# EAGLE design display57 (EAGLE 4.09)
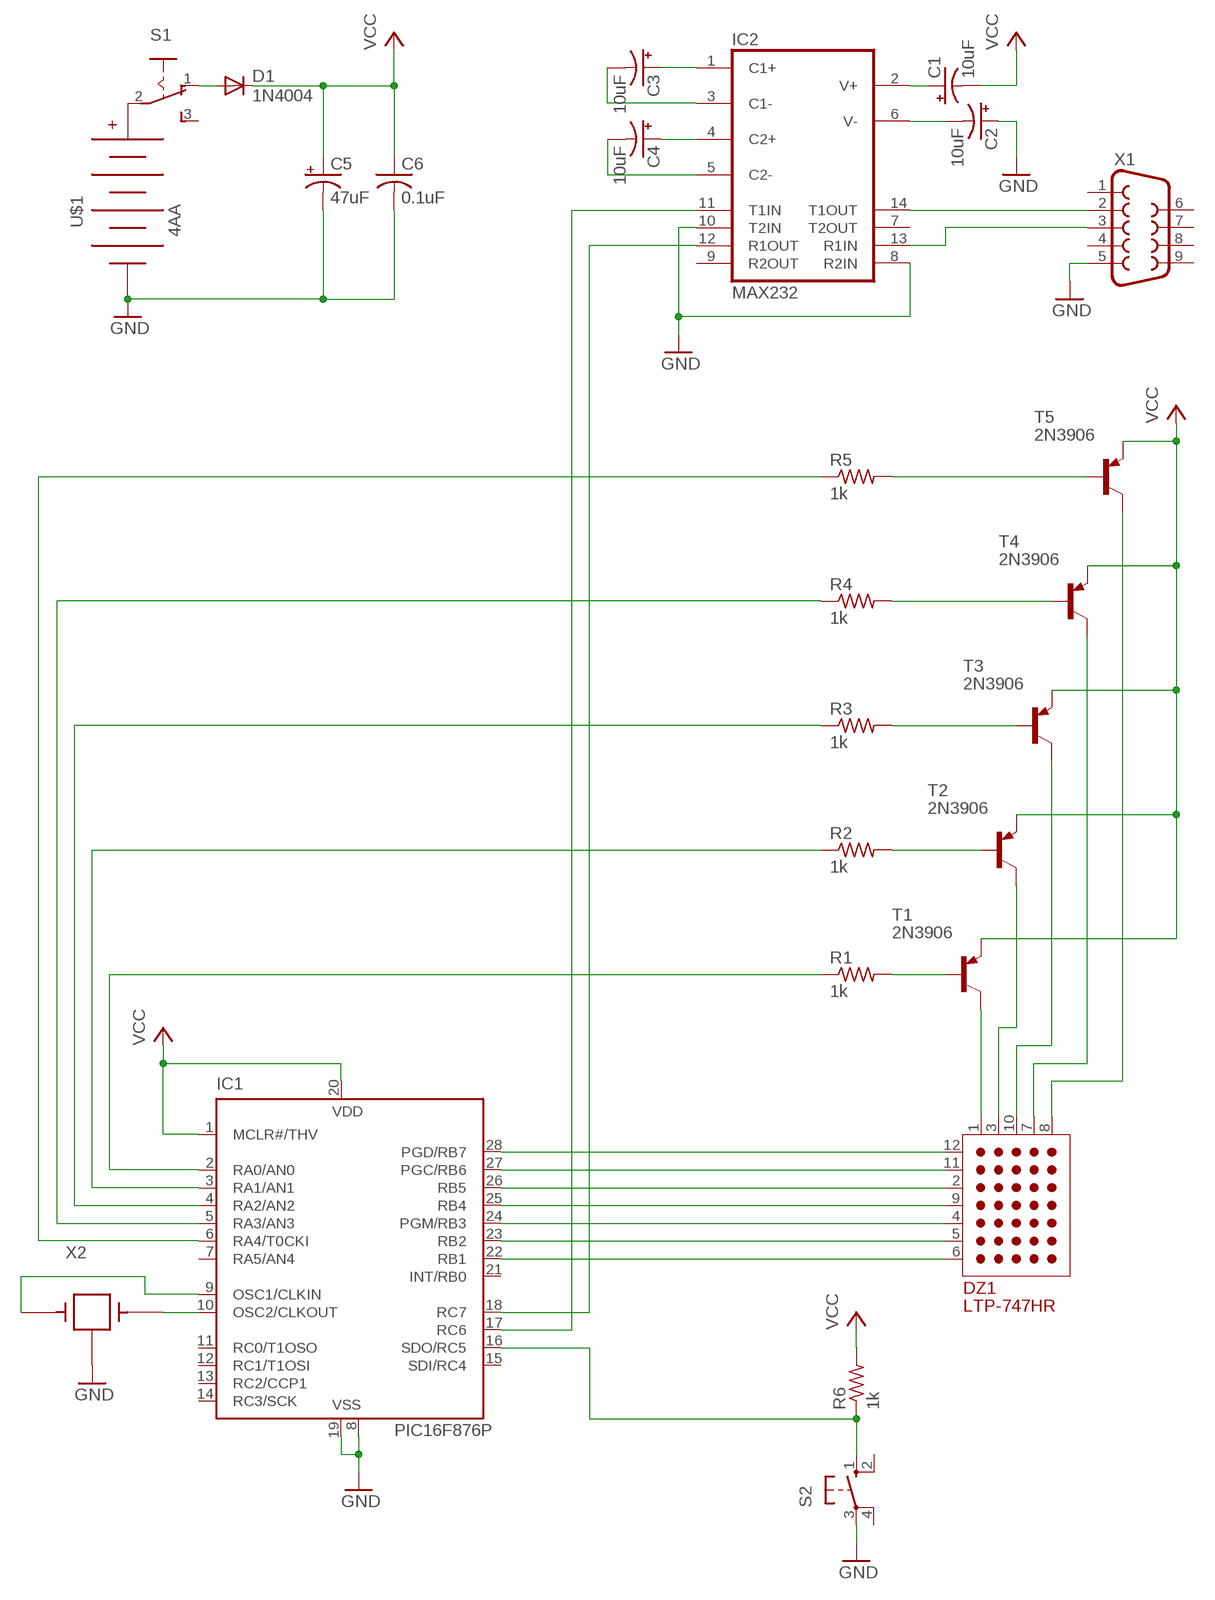
[diagram p0: schematic, sheet 1]

## Parts
C1  10uF  CPOL-USE2.5-5V  [E2,5-4R]
C2  10uF  CPOL-USE2.5-5V  [E2,5-4R]
C3  10uF  CPOL-USE2.5-5V  [E2,5-4R]
C4  10uF  CPOL-USE2.5-5V  [E2,5-4R]
C5  47uF  CPOL-USE5-13  [E5-13]
C6  0.1uF  C-US050-025X075  [C050-025X075]
D1  1N4004  [DO41-10]
DZ1  LTP-747HR  [LTP-747HR]
IC1  PIC16F876P  [DIL28-6]
IC2  MAX232  [DIL16]
R1  1k  R-US_0204/7  [0204/7]
R2  1k  R-US_0204/7  [0204/7]
R3  1k  R-US_0204/7  [0204/7]
R4  1k  R-US_0204/7  [0204/7]
R5  1k  R-US_0204/7  [0204/7]
R6  1k  R-US_0204/7  [0204/7]
S1  M251  [M251]
S2  10-XX  [B3F-10XX]
T1  2N3906  [TO92]
T2  2N3906  [TO92]
T3  2N3906  [TO92]
T4  2N3906  [TO92]
T5  2N3906  [TO92]
U$1  4AA  [4AA]
X1  F09H  [F09H]
X2  CERRES0.2IN  [XTAL0.2IN]

## Nets
GND: C2.+ C5.- C6.2 IC1.8(VSS) IC1.19(VSS) IC2.8(R2IN) IC2.10(T2IN) S2.3(P) U$1.P$2 X1.5 X2.P$3
N$1: IC1.10(OSC2/CLKOUT) X2.P$2
N$2: IC1.9(OSC1/CLKIN) X2.P$1
N$3: C2.- IC2.6(V-)
N$4: C3.+ IC2.1(C1+)
N$5: IC2.13(R1IN) X1.3
N$6: C1.+ IC2.2(V+)
N$7: IC1.17(RC6) IC2.11(T1IN)
N$8: C4.+ IC2.4(C2+)
N$9: C4.- IC2.5(C2-)
N$10: S1.2(P) U$1.P$1
N$11: C3.- IC2.3(C1-)
N$12: IC2.14(T1OUT) X1.2
N$13: R1.2 T1.2(B)
N$14: IC1.18(RC7) IC2.12(R1OUT)
N$15: R5.2 T5.2(B)
N$16: D1.A S1.1(O)
N$17: R2.2 T2.2(B)
N$18: R3.2 T3.2(B)
N$19: R4.2 T4.2(B)
N$20: DZ1.1(C1) T1.1(C)
N$21: DZ1.8(C5) T5.1(C)
N$22: DZ1.7(C4) T4.1(C)
N$23: DZ1.10(C3) T3.1(C)
N$24: DZ1.3(C2) T2.1(C)
N$25: DZ1.12(R1) IC1.28(PGD/RB7)
N$26: DZ1.11(R2) IC1.27(PGC/RB6)
N$27: DZ1.2(R3) IC1.26(RB5)
N$28: DZ1.9(R4) IC1.25(RB4)
N$29: DZ1.4(R5) IC1.24(PGM/RB3)
N$30: DZ1.5(R6) IC1.23(RB2)
N$31: DZ1.6(R7) IC1.22(RB1)
N$32: IC1.16(SDO/RC5) R6.1 S2.1(S)
N$33: IC1.3(RA1/AN1) R2.1
N$34: IC1.4(RA2/AN2) R3.1
N$35: IC1.5(RA3/AN3) R4.1
N$36: IC1.6(RA4/T0CKI) R5.1
N$38: IC1.2(RA0/AN0) R1.1
VCC: C1.- C5.+ C6.1 D1.C IC1.1(MCLR#/THV) IC1.20(VDD) R6.2 T1.3(E) T2.3(E) T3.3(E) T4.3(E) T5.3(E)
Unconnected: IC1.7(RA5/AN4) IC1.11(RC0/T1OSO) IC1.12(RC1/T1OSI) IC1.13(RC2/CCP1) IC1.14(RC3/SCK) IC1.15(SDI/RC4) IC1.21(INT/RB0) IC2.7(T2OUT) IC2.9(R2OUT) S1.3(S) S2.2(S1) S2.4(P1) X1.1 X1.4 X1.6 X1.7 X1.8 X1.9

## Power pins joined to a net without a drawn wire
GND: IC2.15(GND)
VCC: IC2.16(VCC)

## Library data of the parts
C1-C5 = rcl:CPOL-US: POLARIZED CAPACITOR, American symbol
C6 = rcl:C-US: CAPACITOR, American symbol
D1 = diode:1N4004: DIODE general purpose rectifier, 1 A
DZ1 = ledmatrix:LTP-747HR: 5x7 Dot Matrix LED Display
IC1 = microchip:PIC16*876: MICROCONTROLLER flash type
IC2 = maxim:MAX232: RS232 TRANSEIVER
R1-R6 = rcl:R-US_: RESISTOR, American symbol
S1 = switch:M251: SLIDING SWITCH Mors, distributor Buerklin, 11G702
S2 = switch-omron:10-XX: OMRON SWITCH
T1-T5 = transistor-pnp:2N3906: PNP Transistor
U$1 = fred:4AA
X1 = con-subd:F09: SUB-D
X2 = fred:CERRES: Ceramic Resonator w/gnd

## Net classes
0 default: width 0.813 mm

## Board
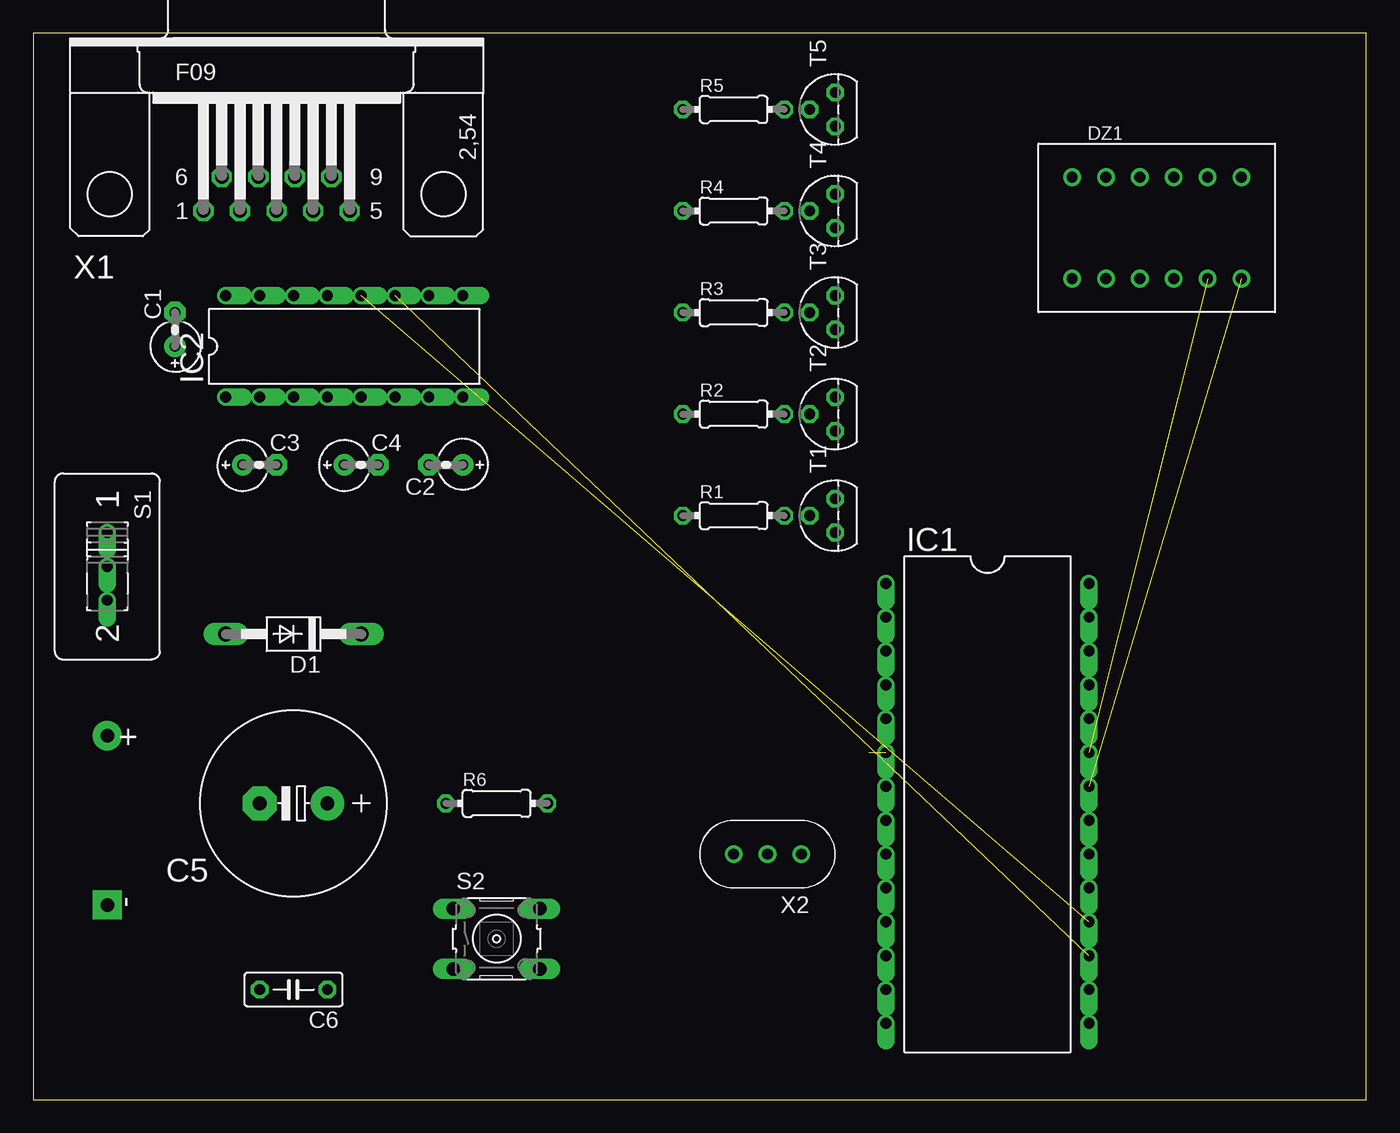
[diagram p1: board, top side]
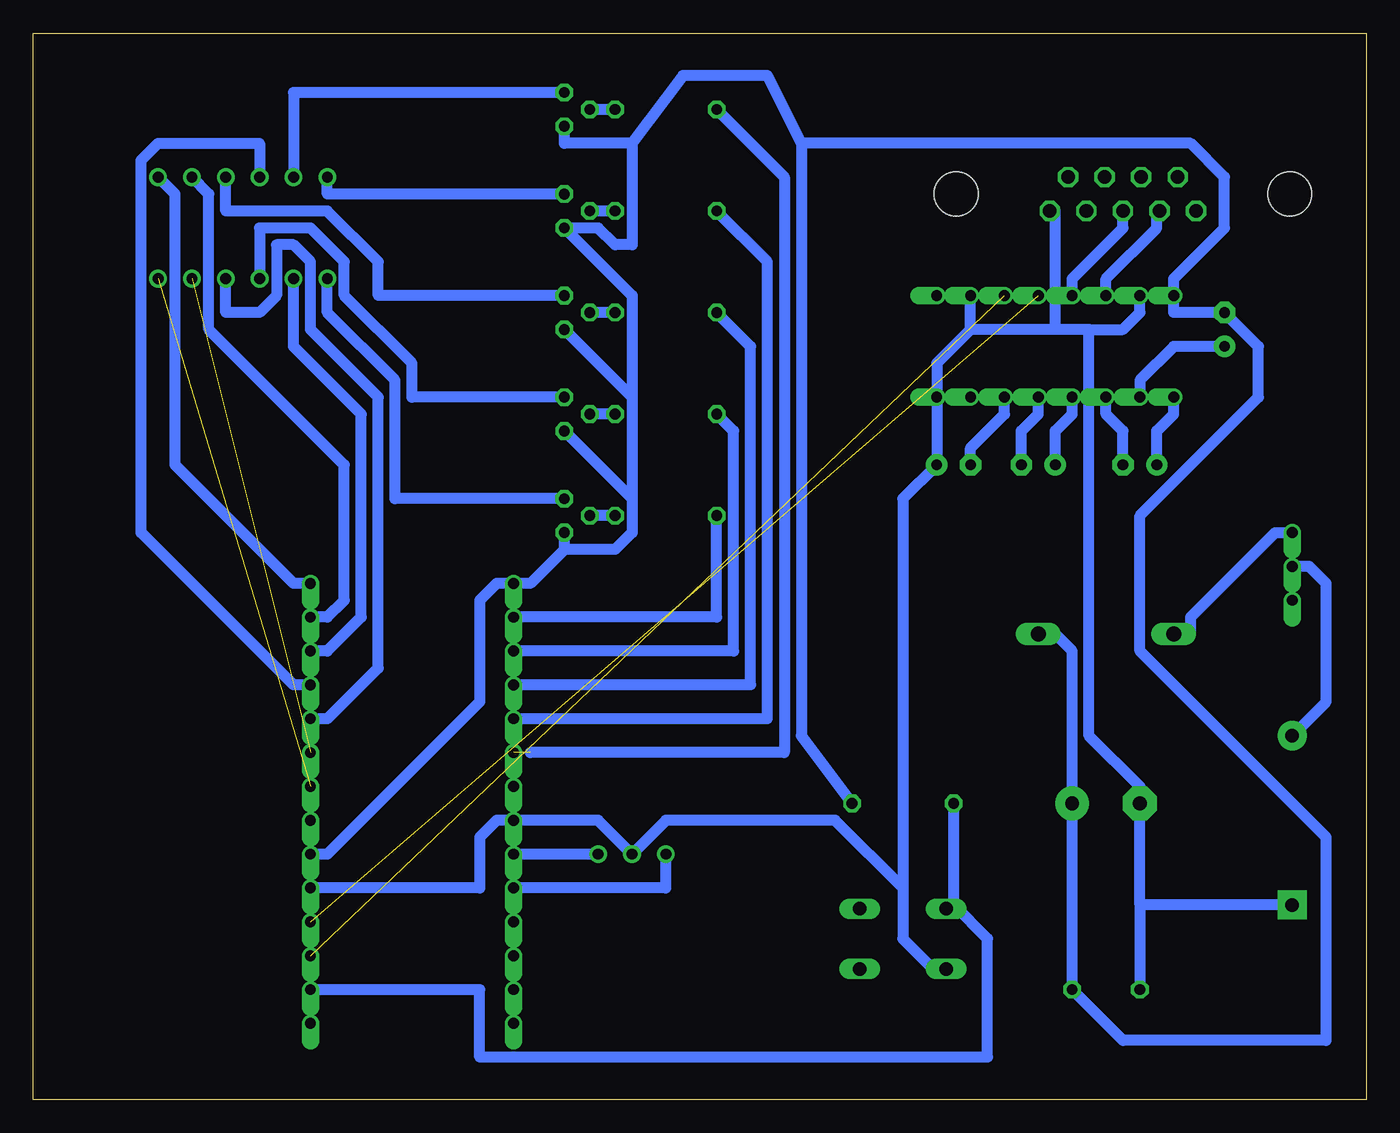
[diagram p2: board, bottom side, seen from below]

Size 100 x 80 mm. Coordinates in mm from the lower left corner, seen from the top.
Outline: 0,0 100,0 100,80 0,80 0,0
Copper layers used: Bottom

### Footprints (pad centres in the part's own frame; a part is rotated, then mirrored left to right if it is on the bottom)
E2,5-4R = drill 0.813 pad 1.6 round: + -1.27,0 | drill 0.813 pad 1.6 octagon: - 1.27,0
E5-13 = drill 1.016 pad 2.54 round: + -2.54,0 | drill 1.016 pad 2.54 octagon: - 2.54,0
C050-025X075 = drill 0.813 octagon: 1 -2.54,0; 2 2.54,0
DO41-10 = drill 1.118 long: A 5.08,0; C -5.08,0
LTP-747HR = drill 0.813 round: 1 -3.81,6.35; 2 -3.81,3.81; 3 -3.81,1.27; 4 -3.81,-1.27; 5 -3.81,-3.81; 6 -3.81,-6.35; 7 3.81,6.35; 8 3.81,3.81; 9 3.81,1.27; 10 3.81,-1.27; 11 3.81,-3.81; 12 3.81,-6.35
DIL28-6 = drill 0.813 offset: 1 -16.51,-7.62; 2 -13.97,-7.62; 3 -11.43,-7.62; 4 -8.89,-7.62; 5 -6.35,-7.62; 6 -3.81,-7.62; 7 -1.27,-7.62; 8 1.27,-7.62; 9 3.81,-7.62; 10 6.35,-7.62; 11 8.89,-7.62; 12 11.43,-7.62; 13 13.97,-7.62; 14 16.51,-7.62; 15 16.51,7.62; 16 13.97,7.62; 17 11.43,7.62; 18 8.89,7.62; 19 6.35,7.62; 20 3.81,7.62; 21 1.27,7.62; 22 -1.27,7.62; 23 -3.81,7.62; 24 -6.35,7.62; 25 -8.89,7.62; 26 -11.43,7.62; 27 -13.97,7.62; 28 -16.51,7.62
DIL16 = drill 0.813 offset: 1 -8.89,-3.81; 2 -6.35,-3.81; 3 -3.81,-3.81; 4 -1.27,-3.81; 5 1.27,-3.81; 6 3.81,-3.81; 7 6.35,-3.81; 8 8.89,-3.81; 9 8.89,3.81; 10 6.35,3.81; 11 3.81,3.81; 12 1.27,3.81; 13 -1.27,3.81; 14 -3.81,3.81; 15 -6.35,3.81; 16 -8.89,3.81
0204/7 = drill 0.813 octagon: 1 -3.81,0; 2 3.81,0
M251 = drill 0.813 offset: 1 -2.54,0; 2 0,0; 3 2.54,0
B3F-10XX = drill 1.016 long: 1 -3.251,2.261; 2 3.251,2.261; 3 -3.251,-2.261; 4 3.251,-2.261
TO92 = drill 0.813 octagon: 1 1.27,0; 2 0,1.905; 3 -1.27,0
4AA = drill 1.016 pad 2.184 round: P$1 -6.35,0 | drill 1.016 pad 2.184 square: P$2 6.35,0
F09H = drill 1.016 octagon: 1 -5.486,-1.27; 2 -2.743,-1.27; 3 0,-1.27; 4 2.743,-1.27; 5 5.486,-1.27; 6 -4.115,1.27; 7 -1.372,1.27; 8 1.372,1.27; 9 4.115,1.27 | hole 3.302: -12.522,0; 12.522,0
XTAL0.2IN = drill 0.813 round: P$1 -2.54,0; P$2 2.54,0; P$3 0,0

### Placement (x,y rotation side)
C1  10.63,57.78 90 top
C2  30.95,47.62 180 top
C3  16.98,47.62 0 top
C4  24.6,47.62 0 top
C5  19.52,22.22 180 top
C6  19.52,8.25 180 top
D1  19.52,34.92 180 top
DZ1  84.29,65.4 90 top
IC1  71.59,22.22 270 top
IC2  23.33,56.51 0 top
R1  52.54,43.81 0 top
R2  52.54,51.43 0 top
R3  52.54,59.05 0 top
R4  52.54,66.67 0 top
R5  52.54,74.29 0 top
R6  34.76,22.22 0 top
S1  5.55,40 270 top
S2  34.76,12.06 0 top
T1  60.16,43.81 90 top
T2  60.16,51.43 90 top
T3  60.16,59.05 90 top
T4  60.16,66.67 90 top
T5  60.16,74.29 90 top
U$1  5.55,20.95 270 top
X1  18.25,67.94 0 top
X2  55.08,18.41 180 top

### Tracks (layer width: path | path; a pad name or v marks a point on that pad's centre or on a via)
GND
  Bottom 0.813: IC1.19 66.51,15.87 66.51,19.68 65.24,20.95 IC1.8 57.62,20.95 X2.P$3 52.54,20.95 39.84,20.95 34.76,15.87 | 16.98,14.6 C6.2 | 16.98,14.6 C5.- 16.98,23.49 20.79,27.3 20.79,57.78 | U$1.P$2 16.98,14.6 | 23.33,57.78 29.68,57.78 | 20.79,57.78 23.33,57.78 | 20.79,57.78 18.25,57.78 16.98,59.05 IC2.15 | 29.68,57.78 IC2.10 | 23.33,57.78 23.33,66.67 X1.5 | 34.76,15.87 34.76,45.08 C2.+ IC2.8 32.22,55.24 29.68,57.78 | 34.76,15.87 34.76,12.06 32.22,9.52 S2.3
N$1
  Bottom 0.813: X2.P$2 52.54,15.87 IC1.10
N$2
  Bottom 0.813: X2.P$1 IC1.9
N$3
  Bottom 0.813: C2.- 29.68,48.89 27.14,51.43 IC2.6
N$4
  Bottom 0.813: C3.+ 15.71,50.16 14.44,51.43 IC2.1
N$5
  Bottom 0.813: X1.3 18.25,65.4 22.06,61.59 IC2.13
N$6
  Bottom 0.813: C1.+ 14.44,56.51 16.98,53.97 IC2.2
N$7  (1 unrouted)
N$8
  Bottom 0.813: C4.+ 23.33,50.16 22.06,51.43 IC2.4
N$9
  Bottom 0.813: C4.- 25.87,50.16 24.6,51.43 IC2.5
N$10
  Bottom 0.813: U$1.P$1 3.01,29.84 3.01,38.73 4.28,40 S1.2
N$11
  Bottom 0.813: C3.- 18.25,50.16 19.52,51.43 IC2.3
N$12
  Bottom 0.813: IC2.14 19.52,61.59 15.71,65.4 15.71,66.67 X1.2
N$13
  Bottom 0.813: R1.2 T1.2
N$14  (1 unrouted)
N$15
  Bottom 0.813: T5.2 R5.2
N$16
  Bottom 0.813: S1.1 6.82,42.54 13.17,36.19 13.17,34.92 D1.A
N$17
  Bottom 0.813: R2.2 T2.2
N$18
  Bottom 0.813: R3.2 T3.2
N$19
  Bottom 0.813: R4.2 T4.2
N$20
  Bottom 0.813: T1.1 72.86,45.08 72.86,53.97 77.94,59.05 DZ1.1
N$21
  Bottom 0.813: T5.1 80.48,75.56 DZ1.8
N$22
  Bottom 0.813: T4.1 77.94,67.94 DZ1.7
N$23
  Bottom 0.813: T3.1 74.13,60.32 74.13,62.86 77.94,66.67 85.56,66.67 DZ1.10
N$24
  Bottom 0.813: T2.1 71.59,52.7 71.59,55.24 76.67,60.32 76.67,62.86 79.21,65.4 83.02,65.4 DZ1.3
N$25
  Bottom 0.813: DZ1.12 89.37,67.94 89.37,47.62 80.48,38.73 IC1.28
N$26
  Bottom 0.813: DZ1.11 86.83,67.94 86.83,57.78 76.67,47.62 76.67,37.46 77.94,36.19 IC1.27
N$27
  Bottom 0.813: DZ1.2 80.48,56.51 75.4,51.43 75.4,36.19 77.94,33.65 IC1.26
N$28
  Bottom 0.813: DZ1.9 83.02,71.75 90.64,71.75 91.91,70.48 91.91,42.54 80.48,31.11 IC1.25
N$29
  Bottom 0.813: DZ1.4 85.56,59.05 83.02,59.05 81.75,60.32 81.75,64.13 80.48,64.13 79.21,62.86 79.21,57.78 74.13,52.7 74.13,32.38 77.94,28.57 IC1.24
N$30  (1 unrouted)
N$31  (1 unrouted)
N$32
  Bottom 0.813: 30.95,14.6 R6.1 | 30.95,14.6 28.41,12.06 28.41,3.17 66.51,3.17 66.51,8.25 IC1.16 | 30.95,14.6 S2.1
N$33
  Bottom 0.813: R2.1 47.46,50.16 47.46,33.65 IC1.3
N$34
  Bottom 0.813: R3.1 46.19,56.51 46.19,31.11 IC1.4
N$35
  Bottom 0.813: R4.1 44.92,62.86 44.92,28.57 IC1.5
N$36  (1 unrouted)
  Bottom 0.813: R5.1 43.65,69.21 43.65,26.03 62.7,26.03
N$38
  Bottom 0.813: R1.1 48.73,36.19 IC1.2
VCC
  Bottom 0.813: 60.16,41.27 62.7,38.73 IC1.1 65.24,38.73 66.51,37.46 66.51,29.84 77.94,18.41 IC1.20 | 60.16,41.27 T1.3 | 55.08,45.08 T2.3 | 55.08,45.08 55.08,42.54 56.35,41.27 60.16,41.27 | 55.08,52.7 T3.3 | 55.08,52.7 55.08,45.08 | 55.08,52.7 55.08,60.32 T4.3 57.62,65.4 56.35,64.13 55.08,64.13 55.08,71.75 | D1.C 23.33,34.92 22.06,33.65 C5.+ C6.1 18.25,4.44 3.01,4.44 3.01,19.68 16.98,33.65 16.98,43.81 8.09,52.7 8.09,56.51 C1.- 14.44,59.05 IC2.16 14.44,61.59 10.63,65.4 10.63,69.21 13.17,71.75 42.38,71.75 | R6.2 42.38,27.3 42.38,71.75 | 55.08,71.75 60.16,71.75 T5.3 | 42.38,71.75 44.92,76.83 51.27,76.83 55.08,71.75